# EasyEDA Pro project 电源管理.epro

# Schematic Schematic1
Create Date: 2023-06-20; Page Name: P1; Project Name: DC-DC_电源; Schematic Name: Schematic1; Update Date: 2023-06-20; Company: 嘉立创EDA; Page Size: A4; Version: V1.0
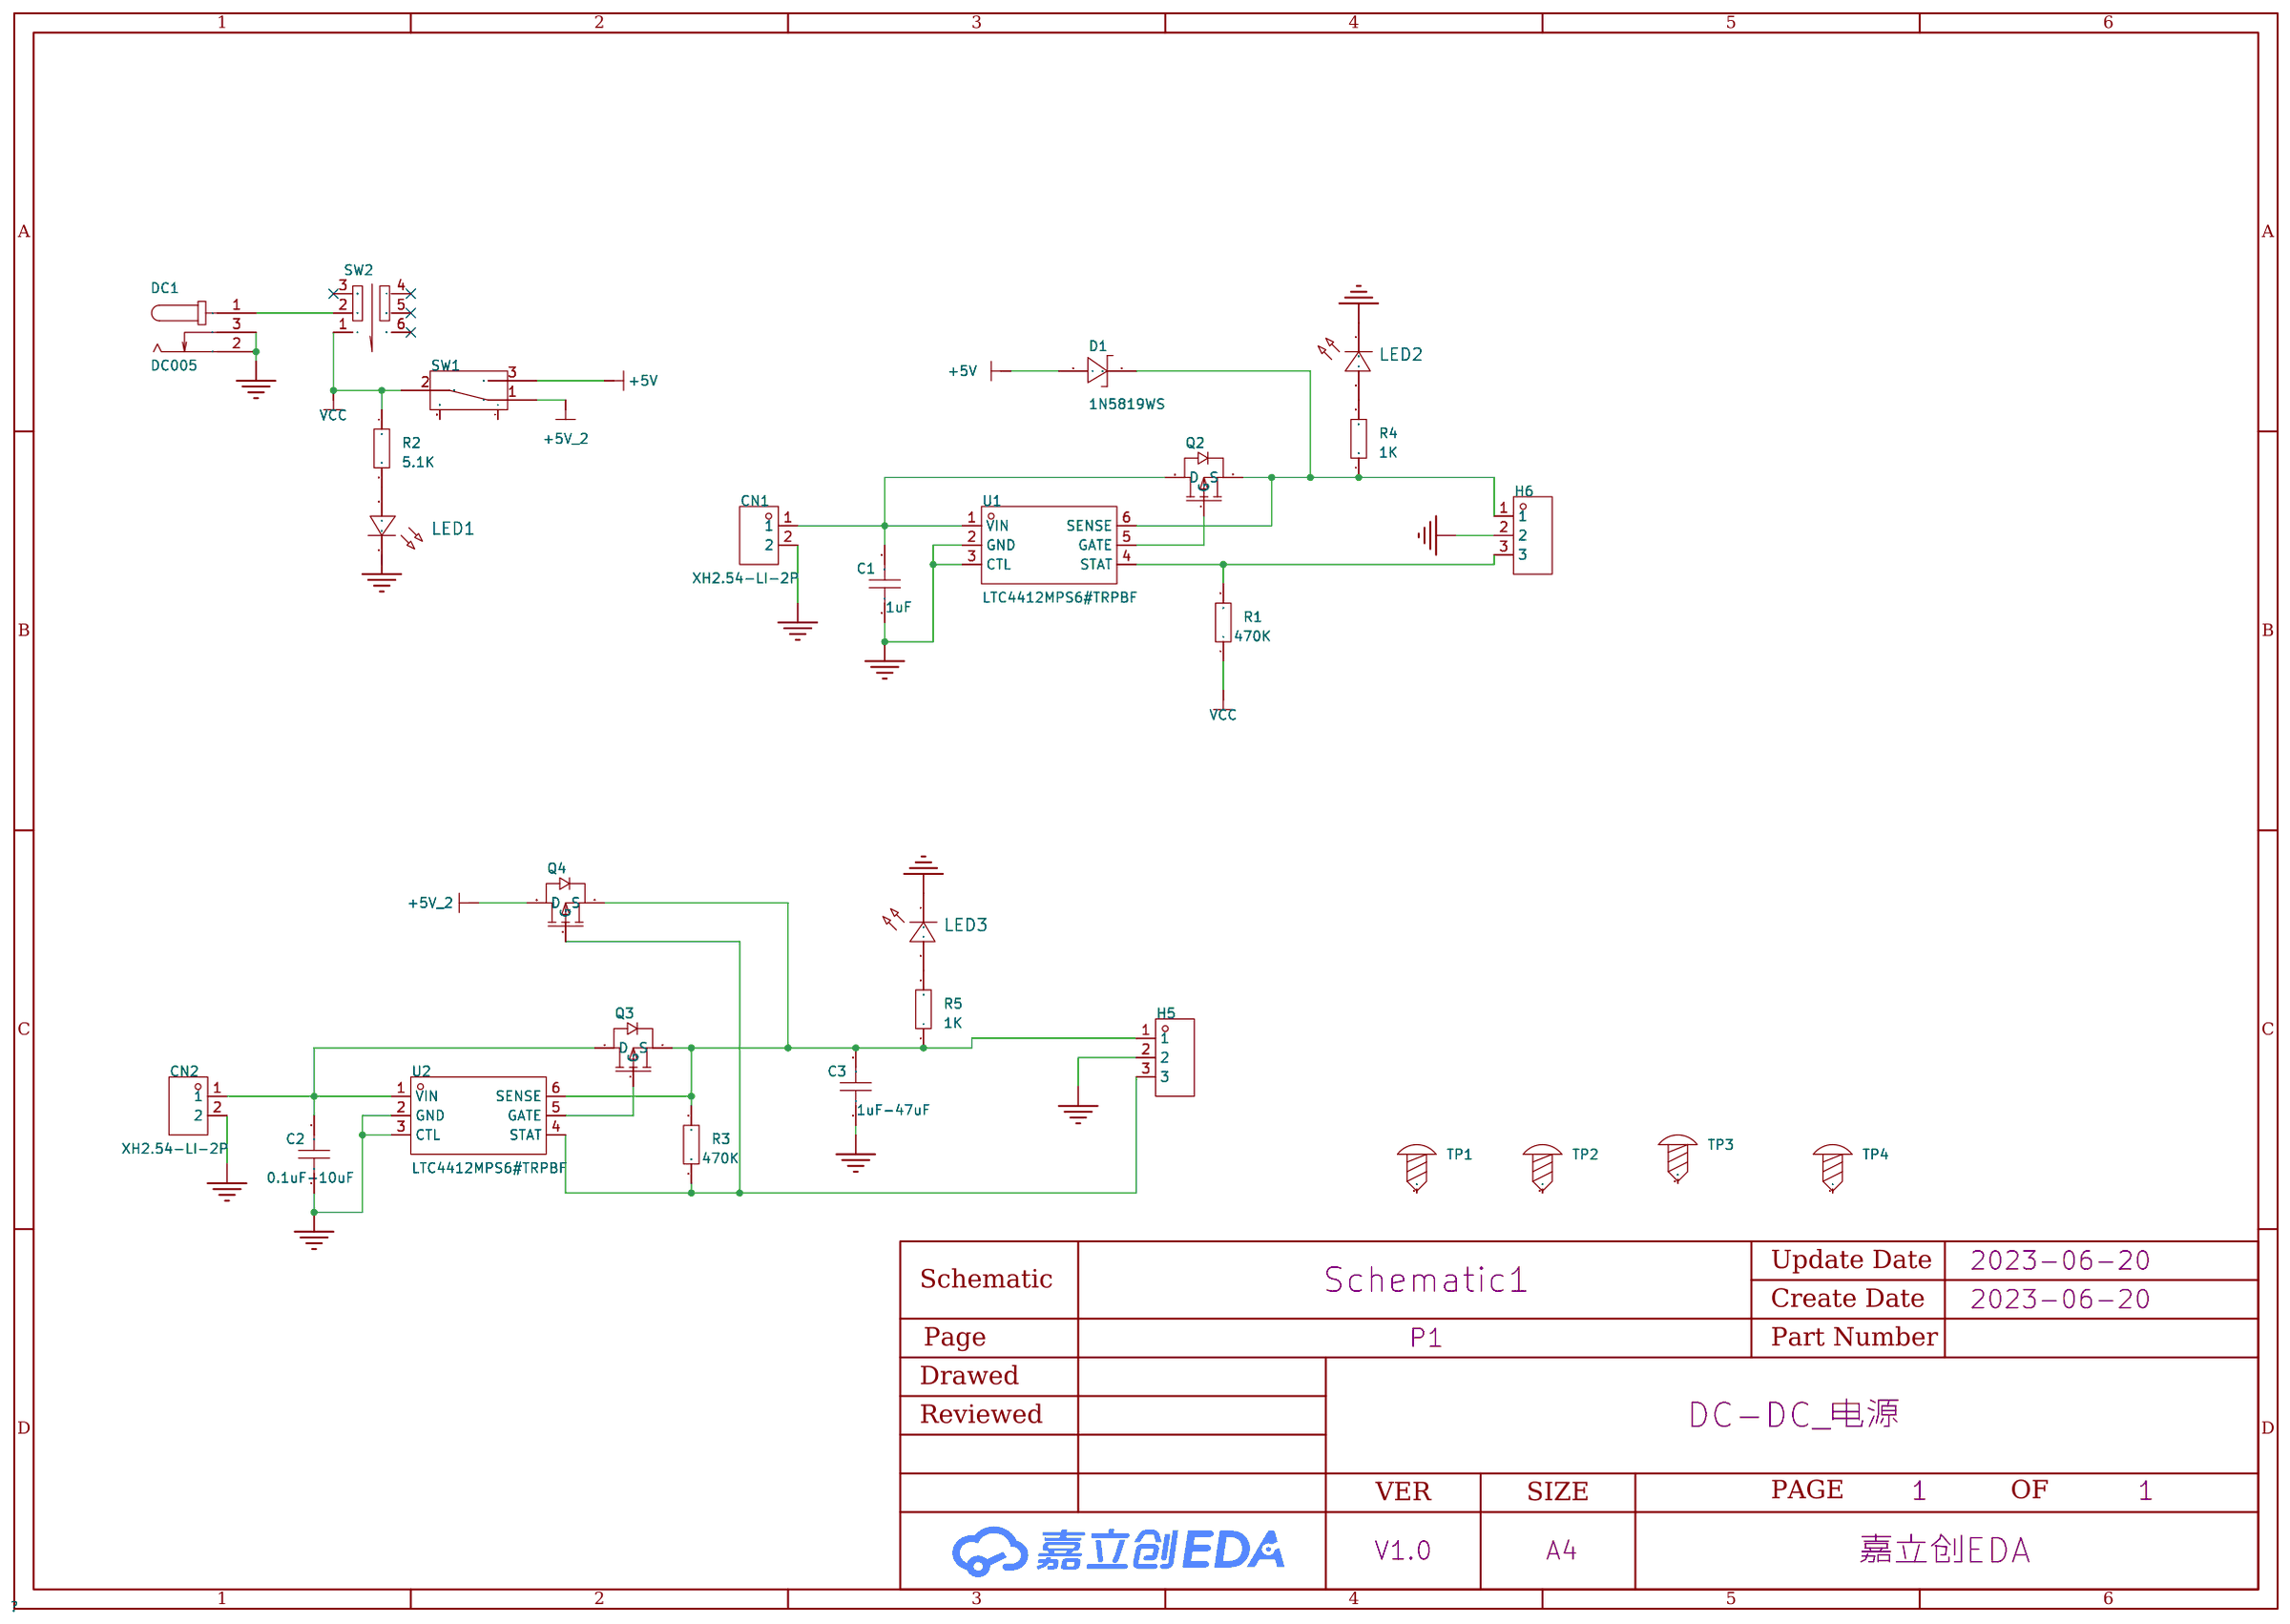
[diagram p0: schematic sheet]

## Parts
C1  1uF  [C0805]
C2  0.1uF-10uF  [C0805]
C3  1uF-47uF  [C0805]
CN1  XH2.54-LI-2P  [CONN-TH_2P-P2.54_HDR2]
CN2  XH2.54-LI-2P  [CONN-TH_2P-P2.54_HDR2]
D1  1N5819WS  [SOD-323_L1.8-W1.3-LS2.5-RD]
DC1  DC005  [DC-IN-TH_DC005]
H5  -  [HDR-TH_3P-P2.54-V-M]
H6  -  [HDR-TH_3P-P2.54-V-M]
LED1  -  [LED_0805]
LED2  -  [LED_0805]
LED3  -  [LED_0805]
Q2  -  [AO3401A_SOT-23-3]
Q3  -  [AO3401A_SOT-23-3]
Q4  -  [AO3401A_SOT-23-3]
R1  470K  [R0805]
R2  5.1K  [R0805]
R3  470K  [R0805]
R4  1K  [R0805]
R5  1K  [R0805]
SW1  -  [拨动开关]
SW2  自锁开关 5.8Z白灰白260G  [SW-TH_6P-L5.8-W5.8-P2.00-LS4.5-TR]
TP1  -  [M3螺丝]
TP2  -  [M3螺丝]
TP3  -  [M3螺丝]
TP4  -  [M3螺丝]
U1  LTC4412MPS6#TRPBF  [SOT-23-6_L2.9-W1.6-P0.95-LS2.8-BL]
U2  LTC4412MPS6#TRPBF  [SOT-23-6_L2.9-W1.6-P0.95-LS2.8-BL]

## Library data of the parts
C1-C3 = CAP_0805: Supplier Footprint: 0805
CN1 CN2 = XH2.54-LI-2P: Supplier Part: C9900023170; Supplier Footprint: CONN-TH_2[; JLCPCB Part Class: Extended Part; Supplier: LCSC
D1 = 1N5819WS_C191023: 直流反向耐压(Vr):40V;平均整流电流(Io):1A;正向压降(Vf):600mV@1A;; LCSC Part Name: 40V 1A 600mV@1A; Supplier Part: C191023; Manufacturer: Hottech(合科泰); Supplier Footprint: SOD-323; JLCPCB Part Class: Basic Part; Datasheet: https://atta.szlcsc.com/upload/public/pdf/source/20220428/3CB86FD8D28D653594B4E35F9D5AEFD9.pdf; Supplier: LCSC; Reverse Voltage (Vr): 40V; Average Rectified Current (Io): 1A; Forward Voltage (Vf@If): 600mV@1A
DC1 = DC005: 连接器类型:DC电源插座;安装方式:弯插;触点内径:2mm;触点外径:6.3mm;额定电流:500mA;额定电压:30V;工作温度范围:-40℃~+55℃;; LCSC Part Name: DC电源插座 内径:2mm 外径:6.3mm 铁材质; Supplier Part: C431533; Manufacturer: SHOU HAN(首韩); Supplier Footprint: 插件; JLCPCB Part Class: Extended Part; Datasheet: https://atta.szlcsc.com/upload/public/pdf/source/20190925/C431533_4751811035784AC1D38EBC85F7905E99.pdf; Supplier: LCSC; Connector Type: DC电源插座; Mounting Style: 弯插; Inside Contact Diameter: 2mm; Outside Contact Diameter: 6.3mm; Current Rating (Max): 500mA; Voltage Rating (Max): 30V; Operating Temperature Range: -40℃~+55℃
H5 H6 = HDR-M_2.54_1x3P: Supplier Part: C2937625; Supplier Footprint: 插件
LED1-LED3 = LED_0805-R: Supplier Footprint: 0805
Q2-Q4 = AO3401A_P: Supplier Footprint: SOT-23-3L; Supplier Part: C15127
R1-R5 = Res_0805: Supplier Footprint: 0805
SW1 = 拨动开关_正: Supplier Footprint: 插件
SW2 = 自锁开关 5.8Z白灰白260G: 耐温260度; LCSC Part Name: 自锁开关 5.8Z白灰白 260G  5.8*5.8mm; Supplier Part: C56857; Supplier Footprint: Through Hole; JLCPCB Part Class: Extended Part; Datasheet: https://atta.szlcsc.com/upload/public/pdf/source/20160318/1458266987096.pdf; Supplier: LCSC
TP1-TP4 = M3螺丝: Supplier Footprint: 插件
U1 U2 = LTC4412MPS6#TRPBF: 输入电压:2.5V~28V;; Supplier Part: C688483; Manufacturer: ADI(亚德诺); Supplier Footprint: SOT-23-6; JLCPCB Part Class: Extended Part; Datasheet: https://atta.szlcsc.com/upload/public/pdf/source/20191127/C459903_E07DB0C4019C6348E4B0C2B47053A4E9.pdf; Supplier: LCSC; Input Voltage: 2.5V~28V; Operating Temperature	-: -40℃~+125℃

## Nets
+5V: D1.2(A) SW1.3
+5V_2: Q4.3(D) SW1.1
GND: C1.1 C2.1 C3.1 CN1.2 CN2.2 DC1.2 DC1.3 H5.2 H6.2 LED1.1(C) LED2.1(C) LED3.1(C) U1.2(GND) U1.3(CTL) U2.2(GND) U2.3(CTL)
VCC: R1.1 R2.1 SW1.2 SW2.1
$1N424: Q2.1(G) U1.5(GATE)
$1N1051: LED1.2(A) R2.2
$1N1391: Q3.1(G) U2.5(GATE)
$1N1660: DC1.1 SW2.2
$1N1753: LED2.2(A) R4.2
$1N1817: LED3.2(A) R5.2
Net-(C1-2): C1.2 CN1.1 Q2.3(D) U1.1(VIN)
Net-(C2-2): C2.2 CN2.1 Q3.3(D) U2.1(VIN)
Net-(C3-2): C3.2 H5.1 Q3.2(S) Q4.2(S) R3.2 R5.1 U2.6(SENSE)
Net-(D1-1): D1.1(C) H6.1 Q2.2(S) R4.1 U1.6(SENSE)
Net-(H5-3): H5.3 Q4.1(G) R3.1 U2.4(STAT)
Net-(H6-3): H6.3 R1.2 U1.4(STAT)

Not connected (* = marked no-connect by the designer): SW1 4 5; SW2 3* 4* 5* 6*; TP1 1; TP2 1; TP3 1; TP4 1

# Schematic Schematic2
Create Date: 2023-07-04; Page Name: P1; Project Name: DC-DC_电源; Schematic Name: Schematic2; Update Date: 2023-07-08; Company: 嘉立创EDA; Page Size: A4; Version: V1.0
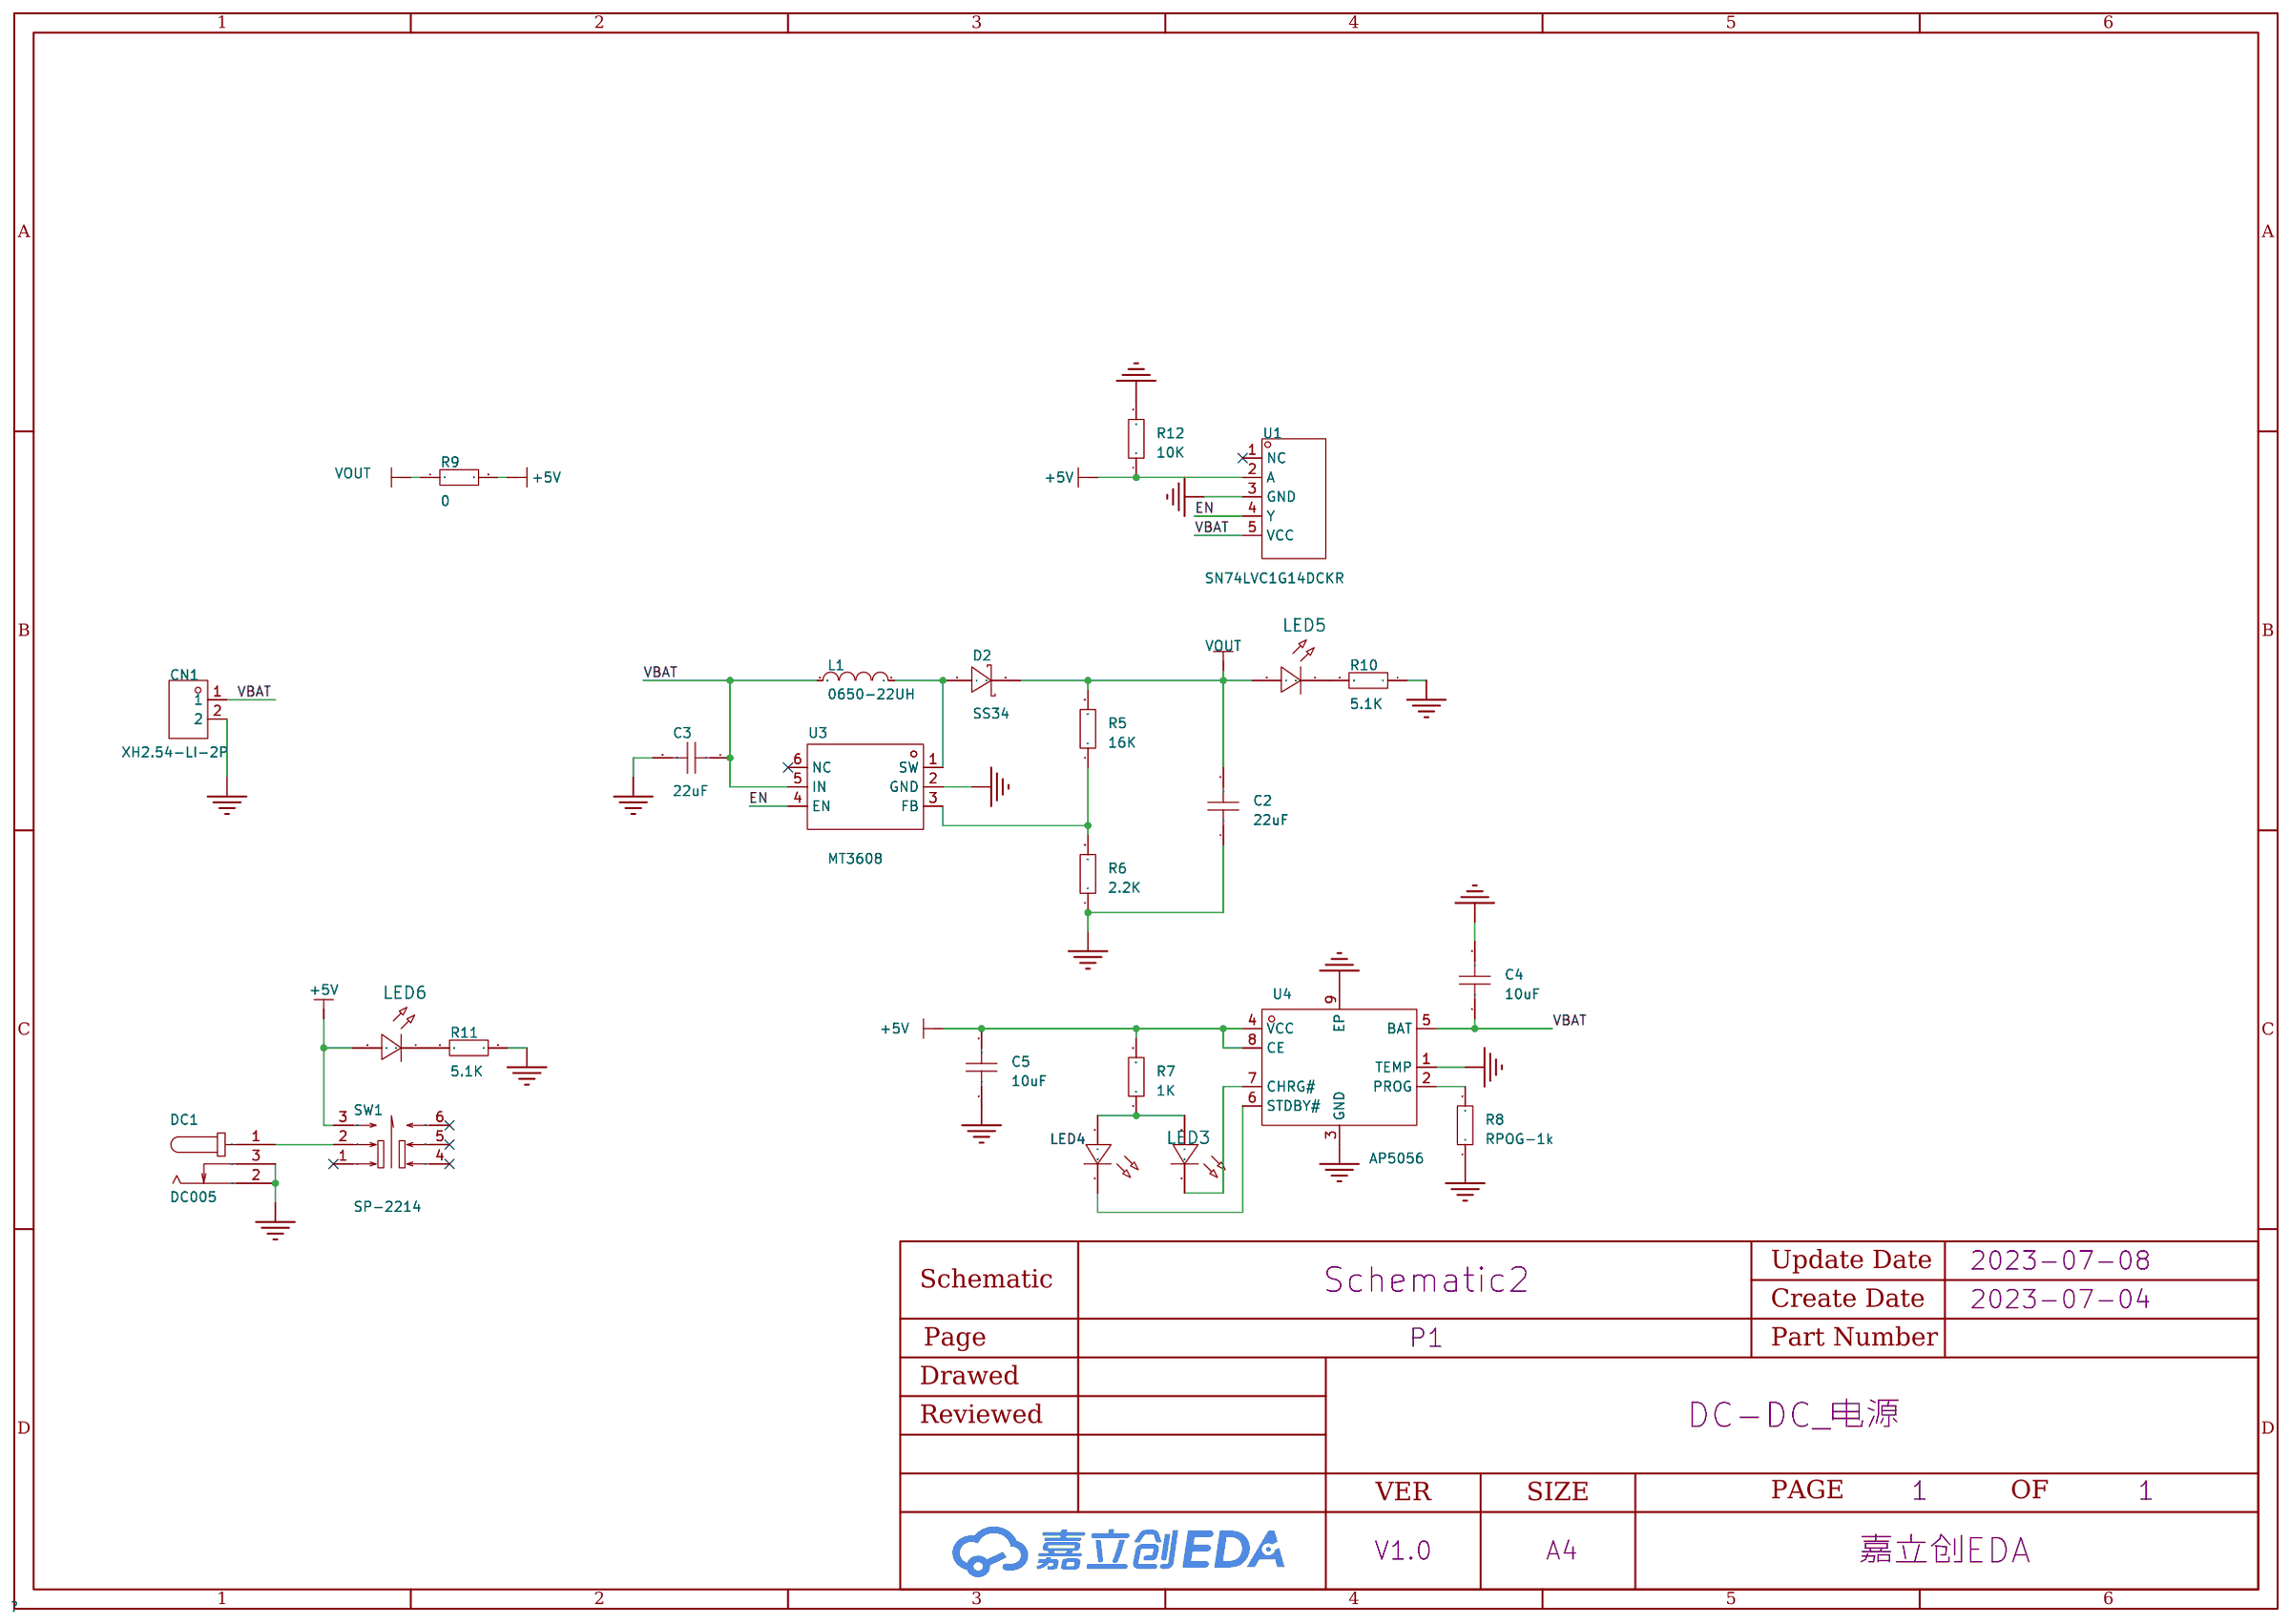
[diagram p1: schematic sheet]

## Parts
C2  22uF  [C0603]
C3  22uF  [C0603]
C4  10uF  [C0603]
C5  10uF  [C0603]
CN1  XH2.54-LI-2P  [CONN-TH_2P-P2.54_HDR2]
D2  SS34  [SMA_L4.3-W2.6-LS5.2-RD]
DC1  DC005  [DC-IN-TH_DC005]
L1  0650-22UH  [IND-SMD_L7.8-W7.0_MAPM0630F]
LED3  -  [LED_0603]
LED4  -  [LED_0603]
LED5  -  [LED_0603]
LED6  -  [LED_0603]
R5  16K  [R0603]
R6  2.2K  [R0603]
R7  1K  [R0603]
R8  RPOG-1k  [R0603]
R9  0  [R0603]
R10  5.1K  [R0603]
R11  5.1K  [R0603]
R12  10K  [R0603]
SW1  SP-2214  [SW-TH_6P-L8.5-W8.5-P2.54-LS5.5]
U1  SN74LVC1G14DCKR  [SOT-23-5_L2.9-W1.6-P0.95-LS2.8-BL]
U3  MT3608  [SOT-23-6_L2.9-W1.6-P0.95-LS2.8-BL]
U4  AP5056  [SOP-8_L4.9-W3.9-P1.27-LS6.0-BL-EP]

## Library data of the parts
C2-C5 = CAP_0603: Supplier Footprint: 0603
CN1 = XH2.54-LI-2P: Supplier Part: C9900023170; Supplier Footprint: CONN-TH_2[; JLCPCB Part Class: Extended Part; Supplier: LCSC
D2 = SS34_C8678: 二极管配置:独立式;直流反向耐压(Vr):40V;平均整流电流(Io):3A;正向压降(Vf):550mV@3A;; LCSC Part Name: 40V 3A 550mV@3A; Supplier Part: C8678; Manufacturer: MDD; Supplier Footprint: SMA(DO-214AC); JLCPCB Part Class: Basic Part; Datasheet: https://atta.szlcsc.com/upload/public/pdf/source/20230314/A80AE34493C69B89E2F4B1712F433538.pdf; Supplier: LCSC; Diode Configuration: 独立式; Reverse Voltage (Vr): 40V; Average Rectified Current (Io): 3A; Forward Voltage (Vf@If): 550mV@3A; Reverse Leakage Current (Ir): 500uA@40V
DC1 = DC005: 连接器类型:DC电源插座;安装方式:弯插;触点内径:2mm;触点外径:6.3mm;额定电流:500mA;额定电压:30V;工作温度范围:-40℃~+55℃;; LCSC Part Name: DC电源插座 内径:2mm 外径:6.3mm 铁材质; Supplier Part: C431533; Manufacturer: SHOU HAN(首韩); Supplier Footprint: 插件; JLCPCB Part Class: Extended Part; Datasheet: https://atta.szlcsc.com/upload/public/pdf/source/20190925/C431533_4751811035784AC1D38EBC85F7905E99.pdf; Supplier: LCSC; Connector Type: DC电源插座; Mounting Style: 弯插; Inside Contact Diameter: 2mm; Outside Contact Diameter: 6.3mm; Current Rating (Max): 500mA; Voltage Rating (Max): 30V; Operating Temperature Range: -40℃~+55℃
L1 = 0650-2.2UH: Supplier Part: C9900012394; Supplier Footprint: SMD_0650; JLCPCB Part Class: Extended Part; Datasheet: https://atta.szlcsc.comnull; Supplier: LCSC
LED3 LED5 LED6 = LED_0603-R: Supplier Footprint: 0603
LED4 = LED_0603-G: Supplier Footprint: 0603
R5-R12 = Res_0603: Supplier Footprint: 0603
SW1 = SP-2214: 触点电流:100mA;额定电压 (DC):30V;绝缘电阻:100MΩ;电路结构:双刀双掷;安装方式:直插;自锁/无锁:自锁;按键形状:矩形柱塞;按键/盖帽颜色:白色;引脚样式:PC引脚;作用力:240gf@±80gf;机械寿命:12000;; LCSC Part Name: 自锁开关; Supplier Part: C589291; Manufacturer: RISHENG(日昇); Supplier Footprint: 插件; JLCPCB Part Class: Extended Part; Datasheet: https://atta.szlcsc.com/upload/public/pdf/source/20200922/C589291_4D429B32154294A859CAFC63DE03822C.pdf; Supplier: LCSC; Contact Current: 100mA; Voltage Rating (DC): 30V; Insulation Resistance: 100MΩ; Circuit: 双刀双掷; Mounting Style: 直插; Self Lock / No Lock: 自锁; Actuator Style: 矩形柱塞; Actuator/Cap Color: 白色; Pin Style: PC引脚; Operating Force: 240gf@±80gf; Mechanical Life: 12000
U1 = SN74LVC1G14DCKR: 输入类型:施密特触发器;通道数:1;电源电压:1.65V~5.5V;电源电流(最大值):10uA;最大传播延迟(tpd):5ns@5V,50pF;; LCSC Part Name: 单路施密特触发反相器; Supplier Part: C35740; Manufacturer: TI(德州仪器); Supplier Footprint: SC-70-5; JLCPCB Part Class: Extended Part; Datasheet: https://atta.szlcsc.com/upload/public/pdf/source/20160416/1460799387530.pdf; Supplier: LCSC; Series: 74LVC; Input Type: 施密特触发器; Number of channels: 1; Supply Voltage(Single): 1.65V~5.5V; Supply Current (Max): 10uA; Sink Current: 32mA; Source Current: 32mA; High level range (VIH): 1.16V~3.33V; Low level range (VIL): 390mV~1.87V; Max Propagation Delay: 5ns@5V,50pF
U3 = MT3608: 功能类型:升压型;输入电压:2V~24V;输出电压:28V;输出电流(最大值):-;; LCSC Part Name: 升压型 输入2V~24V 输出28V; Supplier Part: C84817; Manufacturer: 西安航天民芯; Supplier Footprint: SOT-23-6; JLCPCB Part Class: Extended Part; Datasheet: https://atta.szlcsc.com/upload/public/pdf/source/20161110/1478743351706.pdf; Supplier: LCSC; Function: 升压型; Number of Outputs: 1; Topology: 升压式; Input Voltage: 2V~24V; Output Voltage: 28V; Switching Frequency: 1.2MHz
U4 = AP5056: 常用锂电池充电芯片，功能同TP4056; Supplier Part: C81910; Manufacturer: chipown(芯朋微电子); Supplier Footprint: SOP-8-EP; JLCPCB Part Class: Extended Part; Datasheet: https://atta.szlcsc.com/upload/public/pdf/source/20170918/C81910_1505700200349975039.pdf; Supplier: LCSC

## Nets
+5V: C5.2 LED6.2(A) R7.2 R9.2 R12.1 SW1.3 U1.2(A) U4.4(VCC) U4.8(CE)
GND: C2.1 C3.2 C4.2 C5.1 CN1.2 DC1.2 DC1.3 R6.1 R8.1 R10.1 R11.1 R12.2 U1.3(GND) U3.2(GND) U4.1(TEMP) U4.3(GND) U4.9(EP)
VBAT: C3.1 C4.1 CN1.1 L1.1 U1.5(VCC) U3.5(IN) U4.5(BAT)
EN: U1.4(Y) U3.4(EN)
VOUT: C2.2 D2.1(K) LED5.2(A) R5.2 R9.1
$1N741: D2.2(A) L1.2 U3.1(SW)
$1N828: R5.1 R6.2 U3.3(FB)
$1N1510: DC1.1 SW1.2
$1N2340: LED3.2(A) LED4.2(A) R7.1
$1N2345: LED3.1(C) U4.7(CHRG#)
$1N2357: LED4.1(C) U4.6(STDBY#)
$1N2904: R8.2 U4.2(PROG)
$1N3168: LED5.1(C) R10.2
$1N3244: LED6.1(C) R11.2

Not connected (* = marked no-connect by the designer): SW1 1* 4* 5* 6*; U1 1(NC)*; U3 6(NC)*

# Schematic Schematic3
Create Date: 2023-07-08; Page Name: P1; Project Name: DC-DC_电源; Schematic Name: Schematic3; Update Date: 2023-07-08; Company: 嘉立创EDA; Page Size: A4; Version: V1.0
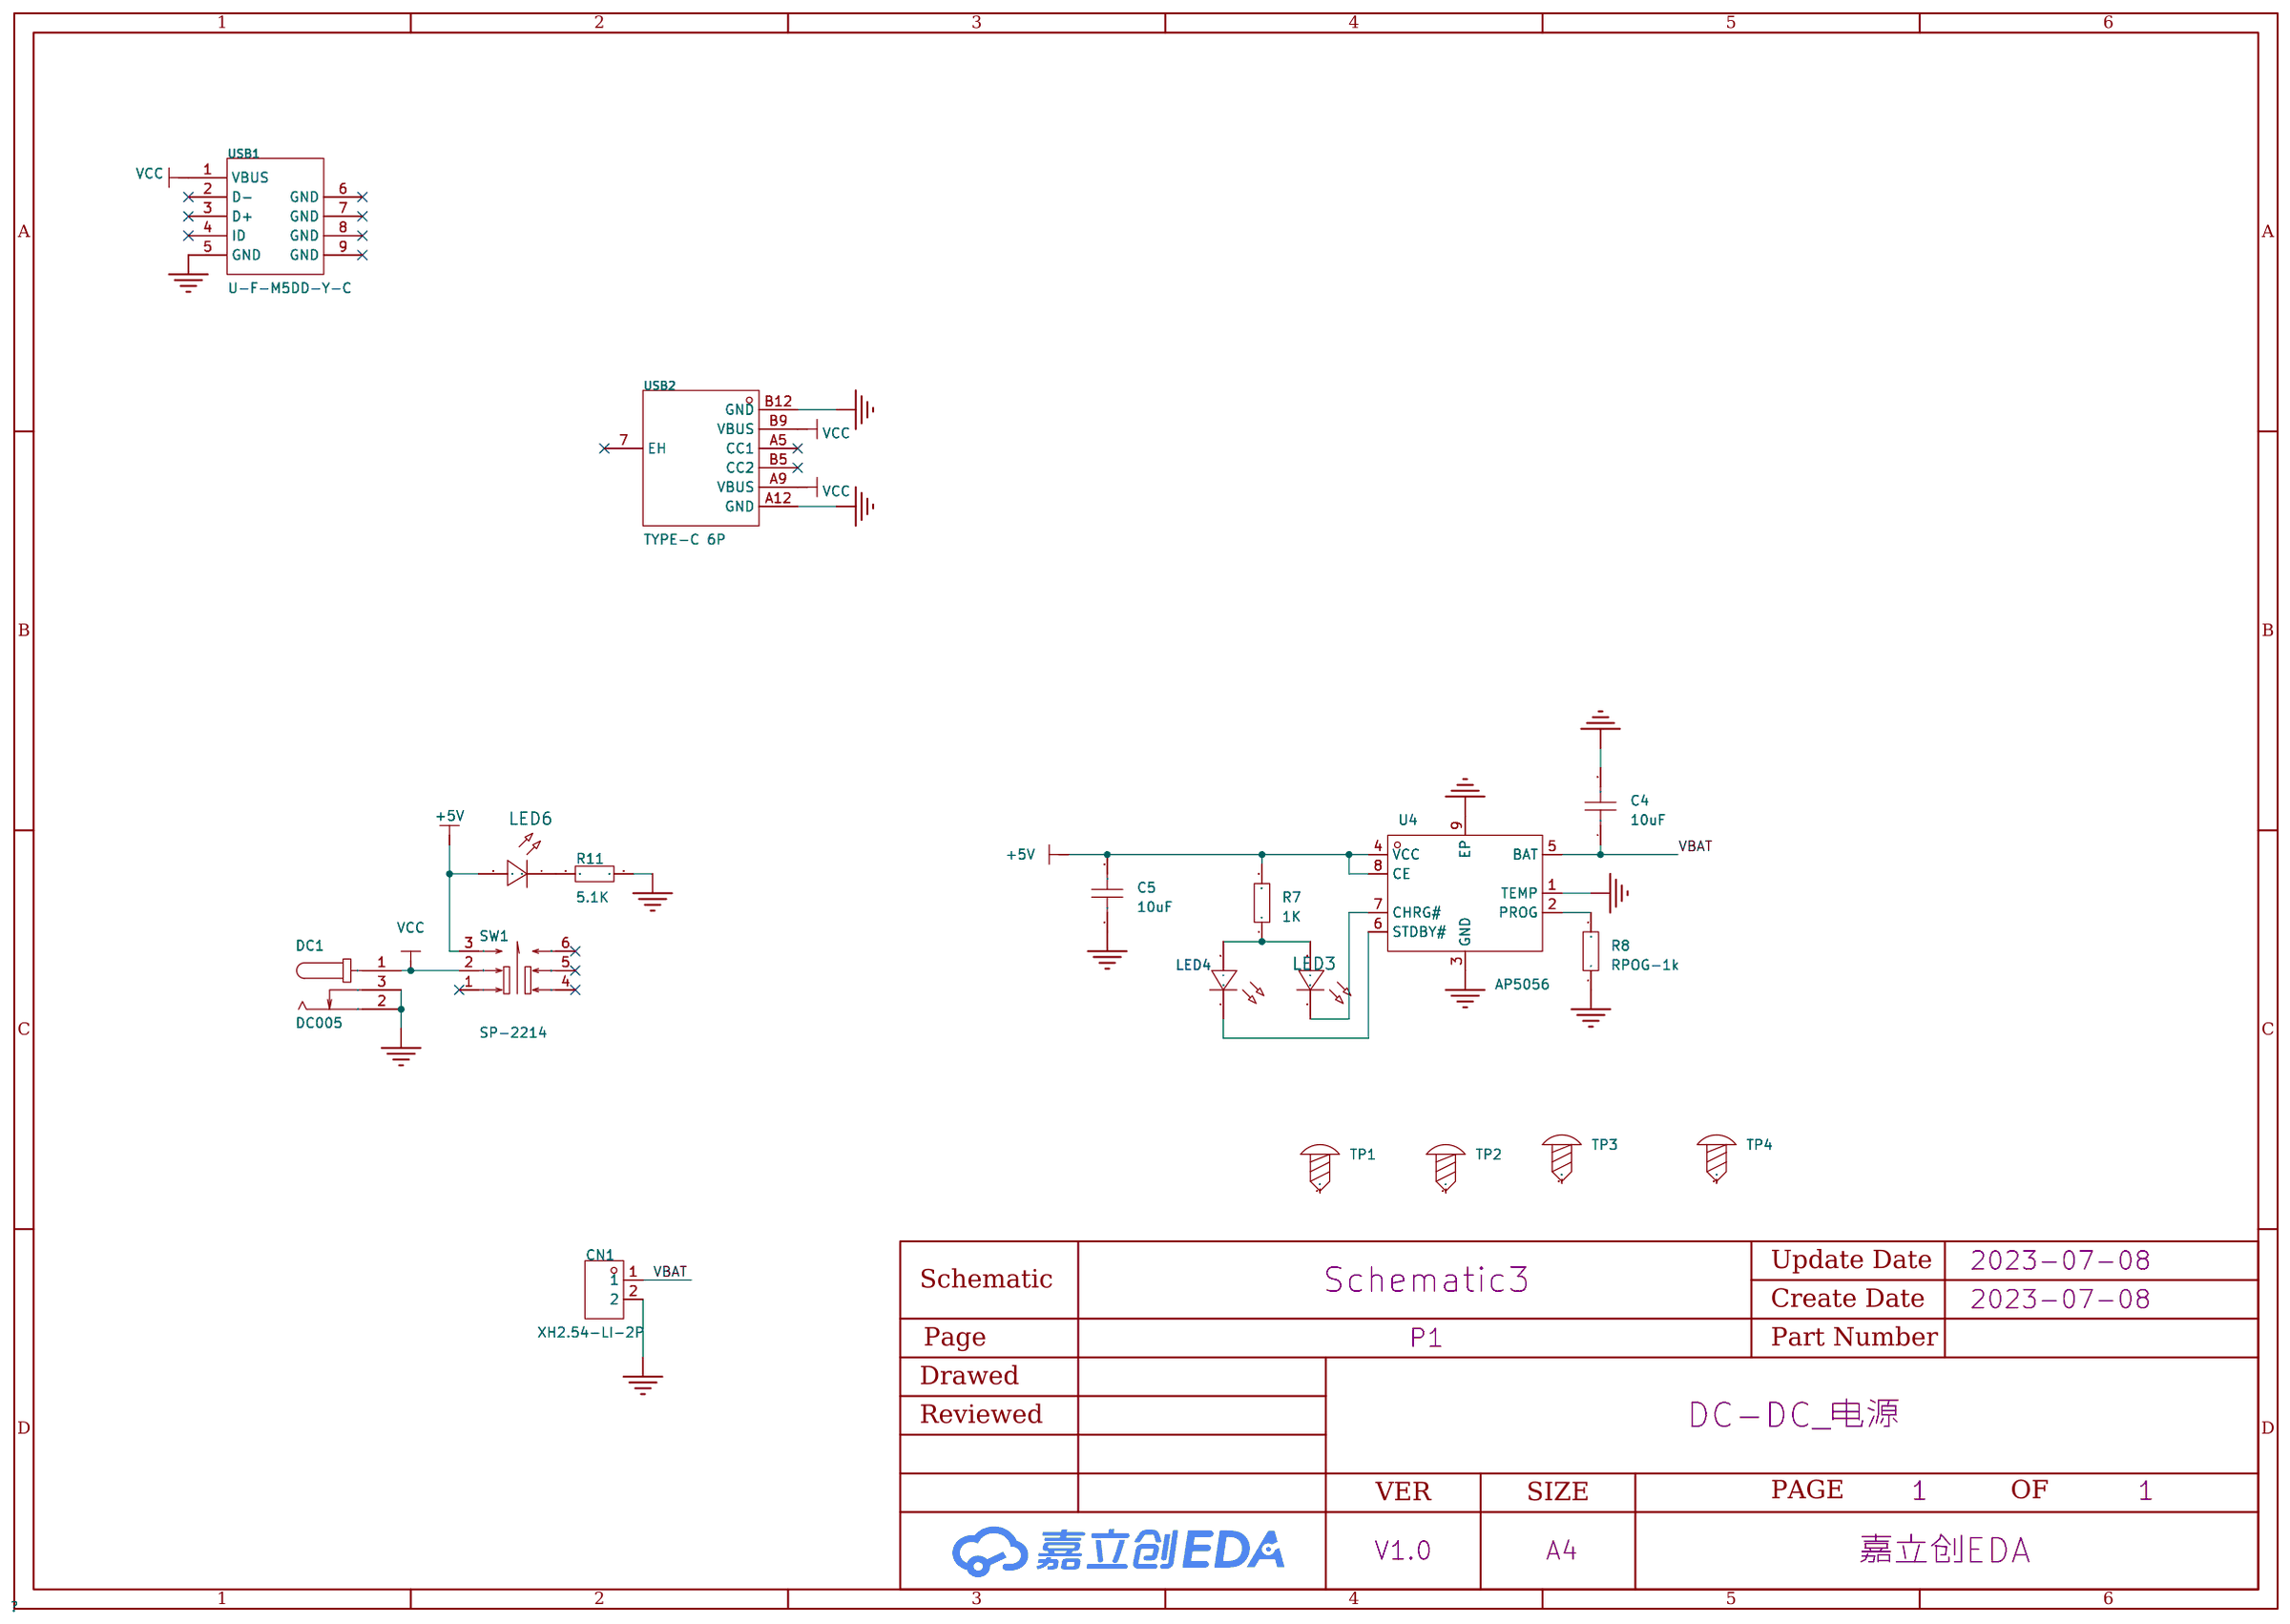
[diagram p2: schematic sheet]

## Parts
C4  10uF  [C0603]
C5  10uF  [C0603]
CN1  XH2.54-LI-2P  [CONN-TH_2P-P2.54_HDR2]
DC1  DC005  [DC-IN-TH_DC005]
LED3  -  [LED_0603]
LED4  -  [LED_0603]
LED6  -  [LED_0603]
R7  1K  [R0603]
R8  RPOG-1k  [R0603]
R11  5.1K  [R0603]
SW1  SP-2214  [SW-TH_6P-L8.5-W8.5-P2.54-LS5.5]
TP1  -  [M3螺丝]
TP2  -  [M3螺丝]
TP3  -  [M3螺丝]
TP4  -  [M3螺丝]
U4  AP5056  [SOP-8_L4.9-W3.9-P1.27-LS6.0-BL-EP]
USB1  U-F-M5DD-Y-C  [MICRO-USB-SMD_U-F-M5DD-Y-C]
USB2  TYPE-C 6P  [TYPE-C-SMD_TYPE-C-6P]

## Library data of the parts
C4 C5 = CAP_0603: Supplier Footprint: 0603
CN1 = XH2.54-LI-2P: Supplier Part: C9900023170; Supplier Footprint: CONN-TH_2[; JLCPCB Part Class: Extended Part; Supplier: LCSC
DC1 = DC005: 连接器类型:DC电源插座;安装方式:弯插;触点内径:2mm;触点外径:6.3mm;额定电流:500mA;额定电压:30V;工作温度范围:-40℃~+55℃;; LCSC Part Name: DC电源插座 内径:2mm 外径:6.3mm 铁材质; Supplier Part: C431533; Manufacturer: SHOU HAN(首韩); Supplier Footprint: 插件; JLCPCB Part Class: Extended Part; Datasheet: https://atta.szlcsc.com/upload/public/pdf/source/20190925/C431533_4751811035784AC1D38EBC85F7905E99.pdf; Supplier: LCSC; Connector Type: DC电源插座; Mounting Style: 弯插; Inside Contact Diameter: 2mm; Outside Contact Diameter: 6.3mm; Current Rating (Max): 500mA; Voltage Rating (Max): 30V; Operating Temperature Range: -40℃~+55℃
LED3 LED6 = LED_0603-R: Supplier Footprint: 0603
LED4 = LED_0603-G: Supplier Footprint: 0603
R7 R8 R11 = Res_0603: Supplier Footprint: 0603
SW1 = SP-2214: 触点电流:100mA;额定电压 (DC):30V;绝缘电阻:100MΩ;电路结构:双刀双掷;安装方式:直插;自锁/无锁:自锁;按键形状:矩形柱塞;按键/盖帽颜色:白色;引脚样式:PC引脚;作用力:240gf@±80gf;机械寿命:12000;; LCSC Part Name: 自锁开关; Supplier Part: C589291; Manufacturer: RISHENG(日昇); Supplier Footprint: 插件; JLCPCB Part Class: Extended Part; Datasheet: https://atta.szlcsc.com/upload/public/pdf/source/20200922/C589291_4D429B32154294A859CAFC63DE03822C.pdf; Supplier: LCSC; Contact Current: 100mA; Voltage Rating (DC): 30V; Insulation Resistance: 100MΩ; Circuit: 双刀双掷; Mounting Style: 直插; Self Lock / No Lock: 自锁; Actuator Style: 矩形柱塞; Actuator/Cap Color: 白色; Pin Style: PC引脚; Operating Force: 240gf@±80gf; Mechanical Life: 12000
TP1-TP4 = M3螺丝: Supplier Footprint: 插件
U4 = AP5056: 常用锂电池充电芯片，功能同TP4056; Supplier Part: C81910; Manufacturer: chipown(芯朋微电子); Supplier Footprint: SOP-8-EP; JLCPCB Part Class: Extended Part; Datasheet: https://atta.szlcsc.com/upload/public/pdf/source/20170918/C81910_1505700200349975039.pdf; Supplier: LCSC
USB1 = U-F-M5DD-Y-C: 连接器类型:Micro-B;标准:USB 2.0;公母:母座;触点数量:5;端口数量:1;安装方式:卧贴;额定电流 - 电源:1A;工作温度范围:-;; LCSC Part Name: 牛角 插件; Supplier Part: C530640; Manufacturer: 韩国韩荣; Supplier Footprint: SMD; JLCPCB Part Class: 扩展库; Supplier: LCSC; Connector Type: Micro-B; Standard: USB 2.0; Gender: 母座; Number of Contacts: 5; Number of Ports: 1; Mounting Style: 卧贴; Current Rating - Power (Max): 1A
USB2 = TYPE-C 6P: 连接器类型:Type-C;标准:-;公母:母座;触点数量:6P;端口数量:1;安装方式:卧贴;额定电流 - 电源:-;工作温度范围:-40℃~+85℃;; LCSC Part Name: Type-C 母座 卧贴; Supplier Part: C456012; Manufacturer: SHOU HAN(首韩); Supplier Footprint: SMD; JLCPCB Part Class: Extended Part; Datasheet: https://atta.szlcsc.com/upload/public/pdf/source/20201203/C456012_B13F72044DF846EDBE9BDD0D1D3CD166.pdf; Supplier: LCSC; Connector Type: Type-C; Gender: 母座; Number of Contacts: 6P; Number of Ports: 1; Mounting Style: 卧贴; Operating Temperature Range: -40℃~+85℃

## Nets
+5V: C5.2 LED6.2(A) R7.2 SW1.3 U4.4(VCC) U4.8(CE)
GND: C4.2 C5.1 CN1.2 DC1.2 DC1.3 R8.1 R11.1 U4.1(TEMP) U4.3(GND) U4.9(EP) USB1.5(GND) USB2.A12(GND) USB2.B12(GND)
VBAT: C4.1 CN1.1 U4.5(BAT)
VCC: DC1.1 SW1.2 USB1.1(VBUS) USB2.A9(VBUS) USB2.B9(VBUS)
Net-(LED3-1): LED3.1(C) U4.7(CHRG#)
Net-(LED3-2): LED3.2(A) LED4.2(A) R7.1
Net-(LED4-1): LED4.1(C) U4.6(STDBY#)
Net-(LED6-1): LED6.1(C) R11.2
Net-(R8-2): R8.2 U4.2(PROG)

Not connected (* = marked no-connect by the designer): SW1 1* 4* 5* 6*; TP1 1; TP2 1; TP3 1; TP4 1; USB1 2(D-)* 3(D+)* 4(ID)* 6(GND)* 7(GND)* 8(GND)* 9(GND)*; USB2 7(EH)* A5(CC1)* B5(CC2)*

# Board PCB2
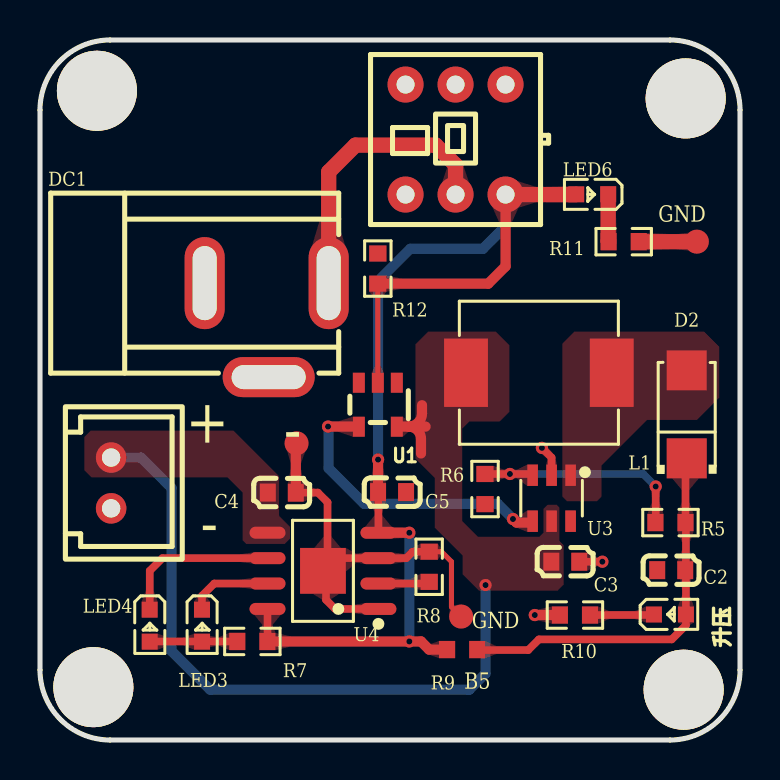
[diagram p3: board, top side]
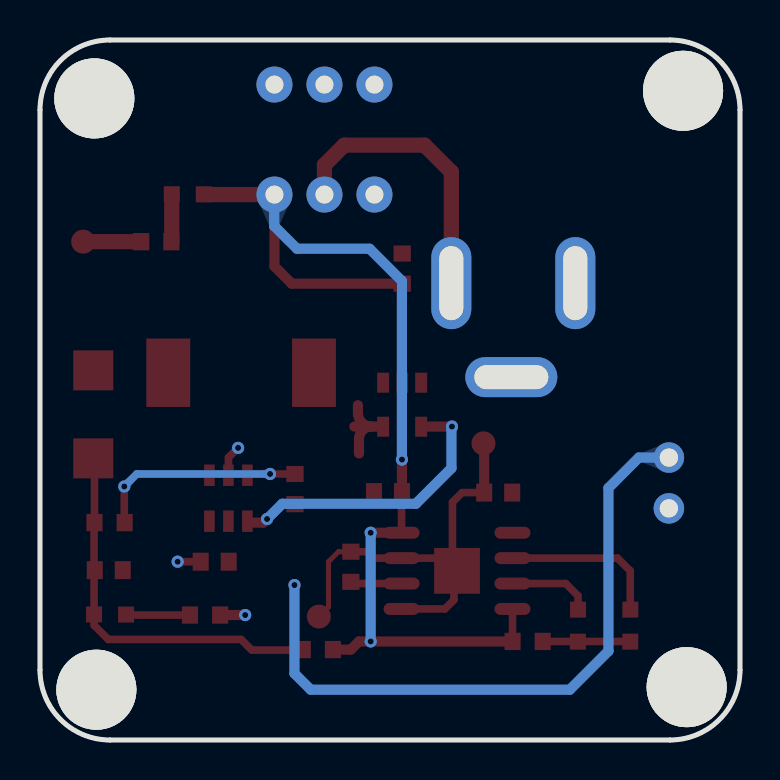
[diagram p4: board, bottom side, seen from below]

Outline 35 x 35 mm; copper layers: Top Layer, Bottom Layer. Coordinates in mm from the lower left corner of the outline.
Outline path: 0,31.5 0,3.5 arc(1.03,1.03) 3.5,0 31.5,0 arc(33.97,1.03) 35,3.5 35,31.5 arc(33.97,33.97) 31.5,35 3.5,35 arc(1.03,33.97) 0,31.5
Stack: Top Layer 0.035mm / Dielectric1 1.51mm FR4 er 4.5 / Bottom Layer 0.035mm

## Design rules (mm)
template: JLCPCB Capability(Two Layers Board)
spacing copperThickness1oz (default): track to track 0.102, other pairs 0.152 to 0.3
spacing copperThickness2oz: track to track 0.203, other pairs 0.152 to 0.3
track width copperThickness1oz (default): min 0.127, default 0.254, max 2.54
track width copperThickness2oz: min 0.203, default 0.254, max 2.54
differential pair differentialPair (default): width min 0.127, default 0.254, max 2.54; gap min 0.152, default 0.152
via viaSize (default): diameter min 0.5, default 0.61, max 10; hole min 0.3, default 0.305, max 6.3

## Placement (name value [footprint] x y rotation side)
C2  22uF  [C0603]  31.56 8.49 0 top
C3  22uF  [C0603]  26.26 8.91 0 top
C4  10uF  [C0603]  12.09 12.37 0 top
C5  10uF  [C0603]  17.6 12.39 180 top
CN1  XH2.54-LI-2P  [CONN-TH_2P-P2.54_HDR2]  3.56 12.85 270 top
D2  SS34  [SMA_L4.3-W2.6-LS5.2-RD]  32.33 16.28 90 top
DC1  DC005  [DC-IN-TH_DC005]  11.33 20.49 0 top
L1  0650-22UH  [IND-SMD_L7.8-W7.0_MAPM0630F]  24.94 18.36 180 top
LED3  -  [LED_0603]  8.11 5.67 270 top
LED4  -  [LED_0603]  5.49 5.67 270 top
LED5  -  [LED_0603]  31.55 6.28 0 top
LED6  -  [LED_0603]  27.56 27.28 180 top
NOREF  -  [Pad_e155]  32.84 24.92 0 top
NOREF#2  -  [Pad_e504]  21.06 6.17 0 top
NOREF#3  -  [Pad_e385]  12.83 14.83 0 top
NOREF#4  -  [Pad_e78]  2.67 2.64 0 top
NOREF#5  -  [Pad_e80]  32.28 32.08 0 top
NOREF#6  -  [Pad_e75]  2.84 32.46 0 top
NOREF#7  -  [Pad_e79]  32.18 2.51 0 top
R5  16K  [R0603]  31.52 10.87 0 top
R6  2.2K  [R0603]  22.25 12.55 90 top
R7  1K  [R0603]  10.62 4.93 0 top
R8  RPOG-1k  [R0603]  19.46 8.66 270 top
R9  0  [R0603]  21.11 4.52 180 top
R10  5.1K  [R0603]  26.75 6.25 0 top
R11  5.1K  [R0603]  29.18 24.92 180 top
R12  10K  [R0603]  16.89 23.57 90 top
SW1  SP-2214  [SW-TH_6P-L8.5-W8.5-P2.54-LS5.5]  20.78 30.02 0 top
U1  SN74LVC1G14DCKR  [SOT-23-5_L2.9-W1.6-P0.95-LS2.8-BL]  16.89 16.76 180 top
U3  MT3608  [SOT-23-6_L2.9-W1.6-P0.95-LS2.8-BL]  25.58 12.09 180 top
U4  AP5056  [SOP-8_L4.9-W3.9-P1.27-LS6.0-BL-EP]  14.15 8.46 90 top

## Footprints (pads in the part's own frame, mm; a bottom-side part is the same pattern mirrored in y, then rotated)
C0603
  rect 0.8x0.9 smd: 1(-0.7,0) 2(0.7,0)
CONN-TH_2P-P2.54_HDR2
  round 1.524 hole 0.914: 1(-1.27,0) 2(1.27,0)
DC-IN-TH_DC005
  oval 2x4.6 hole 1.2x3.7: 1(3.1,2.35) 2(-3.1,2.35)
  oval 4.6x2 hole 3.7x1.2: 3(0.1,-2.35)
IND-SMD_L7.8-W7.0_MAPM0630F
  rect 2.194x3.42 smd: 1(3.643,0) 2(-3.643,0)
LED_0603
  rect 0.8x0.8 smd: 1(-0.851,-0.01) 2(0.75,-0.005)
Pad_e75
  round 4 hole 4: 1(0,0)
Pad_e78
  round 4 hole 4: 1(0,0)
Pad_e79
  round 4 hole 4: 1(0,0)
Pad_e80
  round 4 hole 4: 1(0,0)
Pad_e155
  round 1.2 smd: 2(0,0)
Pad_e385
  round 1.2 smd: 2(0,0)
Pad_e504
  round 1.2 smd: 2(0,0)
R0603
  rect 0.806x0.864 smd: 1(-0.753,0) 2(0.753,0)
SMA_L4.3-W2.6-LS5.2-RD
  rect 2x2 smd: 1(-2.2,0) 2(2.2,0)
SOP-8_L4.9-W3.9-P1.27-LS6.0-BL-EP
  oval 0.6x1.8 smd: 1(-1.905,-2.772) 2(-0.635,-2.772) 3(0.635,-2.772) 4(1.905,-2.772) 5(1.905,2.772) 6(0.635,2.772) 7(-0.635,2.772) 8(-1.905,2.772)
  rect 2.29x2.29 smd: 9(0,0)
SOT-23-5_L2.9-W1.6-P0.95-LS2.8-BL
  rect 0.6x1 smd: 1(-0.95,-1.1) 2(0,-1.1) 3(0.95,-1.1) 4(0.95,1.1) 5(-0.95,1.1)
SOT-23-6_L2.9-W1.6-P0.95-LS2.8-BL
  rect 0.532x1.072 smd: 1(-0.95,-1.149) 2(0,-1.149) 3(0.95,-1.149) 4(0.95,1.149) 5(0,1.149) 6(-0.95,1.149)
SW-TH_6P-L8.5-W8.5-P2.54-LS5.5
  round 1.8 hole 0.9: 1(-2.5,-2.75) 2(0,-2.75) 3(2.5,-2.75) 4(-2.5,2.75) 5(0,2.75) 6(2.5,2.75)

## Nets
As in the schematic, except:
GND: C2.1 C3.2 C4.2 C5.1 CN1.2 DC1.2 DC1.3 NOREF.2 NOREF#2.2 NOREF#3.2 R6.1 R8.1 R10.1 R11.1 R12.2 U1.3 U3.2 U4.1 U4.3 U4.9

Pads without a net: NOREF#4 1; NOREF#5 1; NOREF#6 1; NOREF#7 1; SW1 1 4 5 6; U1 1; U3 6

## Via types
v1: diameter 0.61, hole 0.305, Top Layer to Bottom Layer, 11 vias

## Routing (per net, layer and track width the routed paths; a pad name or vN(x,y) marks a point on that pad's centre or on a via; arc(x,y) is an arc through that point)
+5V: length 58.3
  Top Layer w0.254: U1.2 16.89,22.77 16.94,22.82
  Top Layer w0.381: 11.38,6.55 11.38,5.02 11.47,4.93 ; U4.4 16.92,12.38 C5.2
  Top Layer w0.508: SW1.3 23.28,23.68 22.41,22.82 16.94,22.82 ; U4.4 v1(18.47,10.36) ; R7.2 v1(18.47,4.93) 19.05,4.93 19.46,4.52 R9.2 ; C5.2 v1(16.9,14.02)
  Top Layer w0.762: 26.81,27.28 26.8,27.27 SW1.3
  Bottom Layer w0.508: v1(18.47,4.93) v1(18.47,10.36) ; SW1.3 23.29,27.26 23.29,25.7 22.15,24.56 18.52,24.56 16.9,22.95 v1(16.9,14.02)
GND: length 28.3
  Top Layer w0.254: R8.1 20.07,9.41 20.57,8.91 20.57,6.65 NOREF#2.2
  Top Layer w0.381: R8.1 18.64,9.41 18.31,9.09 U4.3 14.78,9.09 14.65,8.96 ; v1(25.1,14.6) 25.58,14.12 U3.2 ; C4.2 13.89,12.37 14.38,11.89 14.38,8.69 U4.9 14.3,8.31 14.3,7.01 14.76,6.55 U4.1 ; 26.96,8.91 v1(28.12,8.91)
  Top Layer w0.508: NOREF#3.2 12.79,14.8 C4.2 ; R10.1 v1(24.74,6.25)
  Top Layer w0.762: NOREF.2 R11.1
VBAT: length 37.7
  Top Layer w0.508: 19.1,16.74 19.1,16.34 arc(18.91,15.87) 18.43,15.67 ; U1.5 17.84,15.67 18.43,15.67 ; 19.05,14.33 19.05,15.06 arc(18.87,15.49) 18.43,15.67 ; 18.43,15.67 19.28,15.67
  Bottom Layer w0.508: v1(22.28,7.75) 22.28,3.33 21.46,2.51 8.51,2.51 6.58,4.44 6.58,12.6 5.05,14.12 3.56,14.12
EN: length 15
  Top Layer w0.508: 24.63,10.94 24.56,10.87 23.83,10.87 v1(23.65,11.05) ; v1(14.4,15.67) 15.93,15.67 U1.4
  Bottom Layer w0.508: v1(23.65,11.05) 22.89,11.81 16.21,11.81 14.43,13.59 14.43,15.57 14.4,15.6 v1(14.4,15.67)
VOUT: length 19.3
  Top Layer w0.381: D2.1 32.28,14.02 R5.2 32.3,10.85 LED5.2 32.3,5.74 31.59,5.03 24.94,5.03 24.41,4.5 21.89,4.5 R9.1
$1N828: length 11.8
  Top Layer w0.381: U3.3 24.57,13.3 v1(23.5,13.3) R6.2 ; v1(30.78,12.67) 30.78,10.89 R5.1
  Bottom Layer w0.381: v1(30.78,12.67) 30.16,13.3 v1(23.5,13.3)
$1N1510: length 14.3
  Top Layer w0.762: DC1.1 14.43,28.4 15.77,29.74 19.79,29.74 20.78,28.75 SW1.2
$1N2340: length 4.5
  Top Layer w0.381: LED4.2 5.5,4.93 9.97,4.93
$1N2345: length 4.2
  Top Layer w0.381: 8.1,6.52 8.1,7.21 8.71,7.82 11.38,7.82
$1N2357: length 8.1
  Top Layer w0.381: 11.38,9.09 6.12,9.09 5.49,8.46 5.49,6.52 LED4.1
$1N2904: length 2.6
  Top Layer w0.381: U4.2 19.37,7.82 R8.2
$1N3168: length 3.2
  Top Layer w0.381: R10.2 30.67,6.25 LED5.1
$1N3244: length 2.4
  Top Layer w0.762: 28.43,24.92 28.41,24.94 LED6.1

## Copper pours and planes (outline as drawn; the poured copper is in the pictures)
GND on Top Layer: -2.64,35.58 36,35.58 36,-0.23 -2.64,-0.23
GND on Bottom Layer: -2.67,35.51 35.97,35.51 35.97,-0.31 -2.67,-0.31
VBAT on Top Layer: 2.21,15.47 12.5,15.47 12.5,9.8 2.21,9.8
VBAT on Top Layer: 18.77,20.42 26.19,20.42 26.19,7.47 18.77,7.47
$1N741 on Top Layer: 26.12,20.42 33.96,20.42 33.96,11.94 26.12,11.94

Small or netless copper shapes (teardrops, artwork), in the pictures only: 68 on Top Layer, 4 on Bottom Layer

## Text on the board
Top Silkscreen Layer: B5 | GND | 升压 | + | -

# Board PCB3
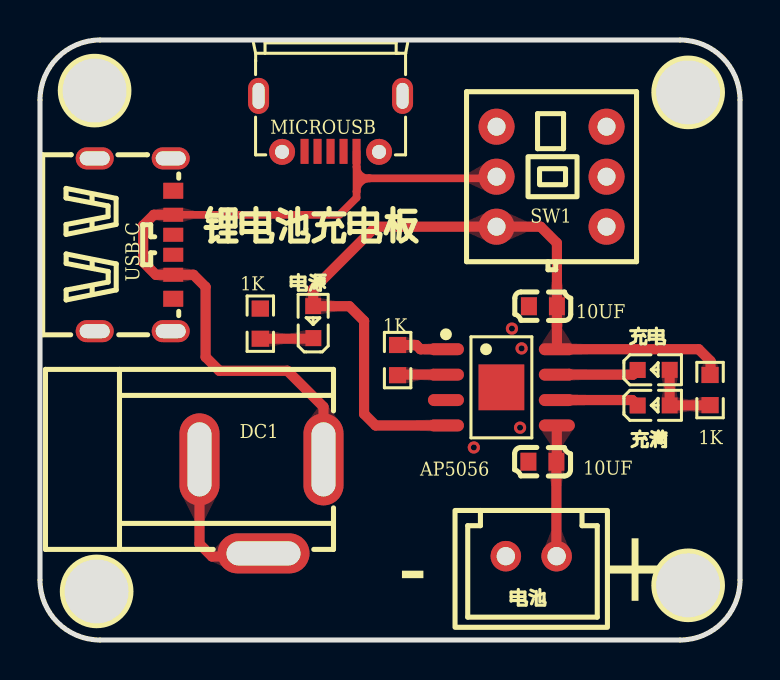
[diagram p5: board, top side]
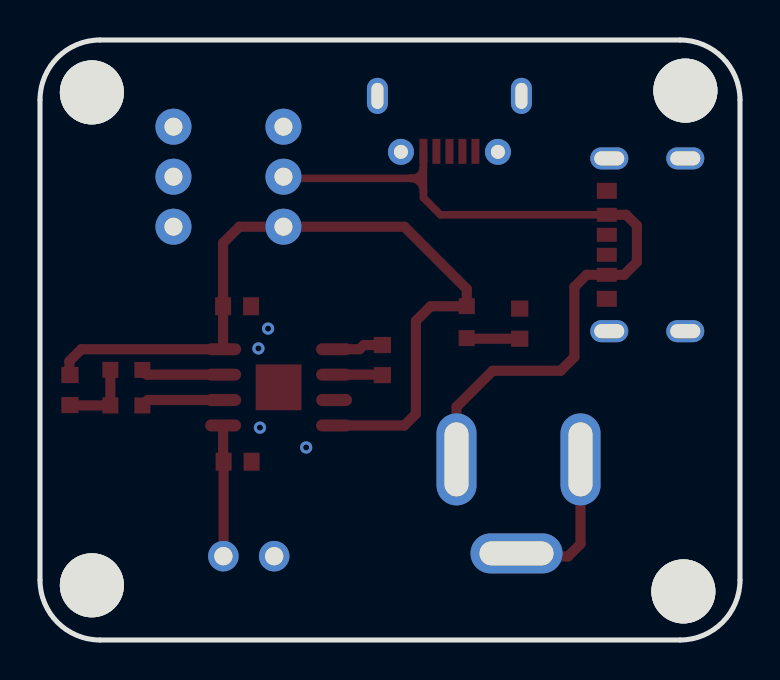
[diagram p6: board, bottom side, seen from below]

Outline 35 x 30 mm; copper layers: Top Layer, Bottom Layer. Coordinates in mm from the lower left corner of the outline.
Outline path: 0,27 0,3 arc(0.88,0.88) 3,0 32,0 arc(34.12,0.88) 35,3 35,27 arc(34.12,29.12) 32,30 3,30 arc(0.88,29.12) 0,27
Stack: Top Layer 0.035mm / Dielectric1 1.51mm FR4 er 4.5 / Bottom Layer 0.035mm

## Design rules (mm)
template: JLCPCB Capability(Two Layers Board)
spacing copperThickness1oz (default): track to track 0.102, other pairs 0.152 to 0.3
spacing copperThickness2oz: track to track 0.203, other pairs 0.152 to 0.3
track width copperThickness1oz (default): min 0.127, default 0.254, max 2.54
track width copperThickness2oz: min 0.203, default 0.254, max 2.54
differential pair differentialPair (default): width min 0.127, default 0.254, max 2.54; gap min 0.152, default 0.152
via viaSize (default): diameter min 0.5, default 0.61, max 10; hole min 0.3, default 0.305, max 6.3

## Placement (name value [footprint] x y rotation side)
1K  -  [R0603]  33.5 12.5 90 top
1K#2  -  [R0603]  17.88 14 270 top
1K#3  -  [R0603]  11.02 15.82 270 top
10UF  -  [C0603]  25.12 8.92 180 top
10UF#2  -  [C0603]  25.15 16.69 0 top
AP5056  -  [SOP-8_L4.9-W3.9-P1.27-LS6.0-BL-EP]  23.07 12.63 270 top
DC1  DC005  [DC-IN-TH_DC005]  11.07 6.68 0 top
MICROUSB  -  [MICRO-USB-SMD_U-F-M5DD-Y-C]  14.53 25.81 180 top
SW1  SP-2214  [SW-TH_6P-L8.5-W8.5-P2.54-LS5.5]  25.58 23.17 270 top
TP1  -  [M3螺丝]  2.9 2.37 0 top
TP2  -  [M3螺丝]  2.79 27.41 0 top
TP3  -  [M3螺丝]  32.47 27.32 0 top
TP4  -  [M3螺丝]  32.47 2.67 0 top
USB-C
  -  [TYPE-C-SMD_TYPE-C-6P]  4.7 19.76 270 top
充满  -  [LED_0603]  30.73 11.73 0 top
充电  -  [LED_0603]  30.73 13.51 0 top
电池  -  [CONN-TH_2P-P2.54_HDR2]  24.56 4.19 180 top
电源  -  [LED_0603]  13.66 15.94 90 top

## Footprints (pads in the part's own frame, mm; a bottom-side part is the same pattern mirrored in y, then rotated)
C0603
  rect 0.8x0.9 smd: 1(-0.7,0) 2(0.7,0)
CONN-TH_2P-P2.54_HDR2
  round 1.524 hole 0.914: 1(-1.27,0) 2(1.27,0)
DC-IN-TH_DC005
  oval 2x4.6 hole 1.2x3.7: 1(3.1,2.35) 2(-3.1,2.35)
  oval 4.6x2 hole 3.7x1.2: 3(0.1,-2.35)
LED_0603
  rect 0.8x0.8 smd: 1(-0.851,-0.01) 2(0.75,-0.005)
M3螺丝
  round 3.2 hole 3.2: 1(-0.064,0.064)
MICRO-USB-SMD_U-F-M5DD-Y-C
  rect 0.4x1.25 smd: 1(-1.3,1.375) 2(-0.65,1.375) 3(0,1.375) 4(0.65,1.375) 5(1.3,1.375)
  round 1.3 hole 0.7: 6(-2.425,1.4) 7(2.425,1.4)
  oval 1.05x1.8 hole 0.6x1.3: 8(-3.6,-1.4) 9(3.6,-1.4)
R0603
  rect 0.806x0.864 smd: 1(-0.753,0) 2(0.753,0)
SOP-8_L4.9-W3.9-P1.27-LS6.0-BL-EP
  oval 0.6x1.8 smd: 1(-1.905,-2.772) 2(-0.635,-2.772) 3(0.635,-2.772) 4(1.905,-2.772) 5(1.905,2.772) 6(0.635,2.772) 7(-0.635,2.772) 8(-1.905,2.772)
  rect 2.29x2.29 smd: 9(0,0)
SW-TH_6P-L8.5-W8.5-P2.54-LS5.5
  round 1.8 hole 0.9: 1(-2.5,-2.75) 2(0,-2.75) 3(2.5,-2.75) 4(-2.5,2.75) 5(0,2.75) 6(2.5,2.75)
TYPE-C-SMD_TYPE-C-6P
  oval 1.1x1.9 hole 0.7x1.5: 7(-4.32,1.837) 7(-4.32,-1.962) 7(4.32,1.837) 7(4.32,-1.962)
  rect 0.7x1 smd: A5(-0.5,1.962) A9(1.5,1.962) B5(0.5,1.962) B9(-1.5,1.962)
  rect 0.8x1 smd: A12(2.7,1.962) B12(-2.7,1.962)

## Nets
+5V: 1K.2 10UF#2.2 AP5056.4 AP5056.8 SW1.3 电源.2
GND: 1K#2.1 1K#3.1 10UF.2 10UF#2.1 AP5056.1 AP5056.3 AP5056.9 DC1.2 DC1.3 MICROUSB.5 USB-C
.A12 USB-C
.B12 电池.2
VBAT: 10UF.1 AP5056.5 电池.1
VCC: DC1.1 MICROUSB.1 SW1.2 USB-C
.A9 USB-C
.B9
$1N946: 1K.1 充满.2 充电.2
$1N947: AP5056.7 充电.1
$1N948: AP5056.6 充满.1
$1N950: 1K#2.2 AP5056.2
$1N960: 1K#3.2 电源.1

Pads without a net: MICROUSB 2 3 4 6 7 8 9; SW1 1 4 5 6; TP1 1; TP2 1; TP3 1; TP4 1; USB-C
 7 A5 B5

## Via types
v1: diameter 0.61, hole 0.305, Top Layer to Bottom Layer, 4 vias

## Routing (per net, layer and track width the routed paths; a pad name or vN(x,y) marks a point on that pad's centre or on a via; arc(x,y) is an arc through that point)
+5V: length 40.4
  Top Layer w0.508: AP5056.4 16.78,10.73 16.21,11.3 16.21,15.95 15.47,16.69 13.67,16.69 电源.2 13.66,17.55 16.78,20.67 SW1.3 25.03,20.67 25.85,19.85 10UF#2.2 25.85,14.54 AP5056.8 32.93,14.54 33.53,13.94 33.53,13.28 1K.2
GND: length 10
  Top Layer w0.508: AP5056.1 19.02,14.54 18.81,14.75 17.88,14.75 ; 11.17,4.18 8.6,4.18 7.98,4.8 7.98,8.88
  vias: v1(21.69,9.63) v1(23.6,15.57) v1(24,10.62) v1(24.08,14.58)
VBAT: length 6.4
  Top Layer w0.508: 10UF.1 25.82,4.2 电池.1 ; AP5056.5 25.84,9.1
VCC: length 40.6
  Top Layer w0.381: MICROUSB.1 15.83,23.66 ; 15.83,23.66 15.83,22.43 ; 15.83,23.66 arc(16,23.25) 16.4,23.08 16.49,23.08 ; USB-C
.B9 14.98,21.26 15.83,22.11 15.83,22.43 ; 15.83,22.43 arc(16.02,22.89) 16.49,23.08 ; 16.49,23.08 22.75,23.08 SW1.2
  Top Layer w0.508: USB-C
.B9 5.69,21.26 5.16,20.73 5.16,18.9 5.79,18.26 USB-C
.A9 7.67,18.26 8.28,17.65 8.28,14.15 8.97,13.46 12.37,13.46 14.17,11.66 14.17,8.88
$1N946: length 3.8
  Top Layer w0.508: 1K.1 33.49,11.73 充满.2 充电.2
$1N947: length 4.1
  Top Layer w0.508: AP5056.7 29.65,13.27 29.88,13.5
$1N948: length 4.2
  Top Layer w0.508: AP5056.6 29.61,12 充满.1
$1N950: length 2.4
  Top Layer w0.508: AP5056.2 17.91,13.27 1K#2.2
$1N960: length 2.7
  Top Layer w0.508: 13.67,15.09 13.64,15.06 1K#3.2

## Copper pours and planes (outline as drawn; the poured copper is in the pictures)
GND on Top Layer: -0.38,31.7 35.97,31.7 35.97,-1.02 -0.38,-1.02
GND on Top Layer: -0.38,31.7 35.97,31.7 35.97,-1.02 -0.38,-1.02

Small or netless copper shapes (teardrops, artwork), in the pictures only: 35 on Top Layer

## Text on the board
Top Silkscreen Layer: 锂电池充电板 | - | +

# Board PCB1
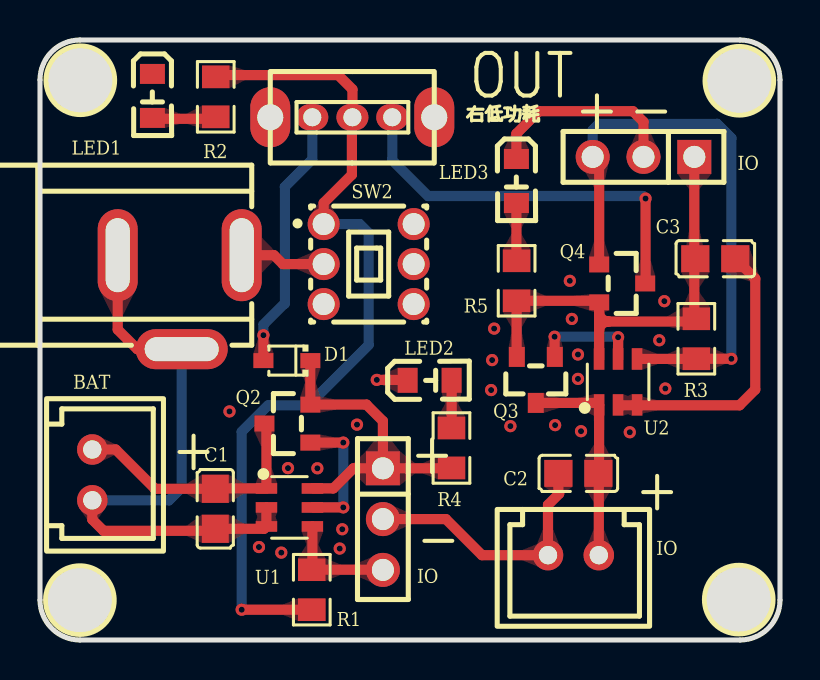
[diagram p7: board, top side]
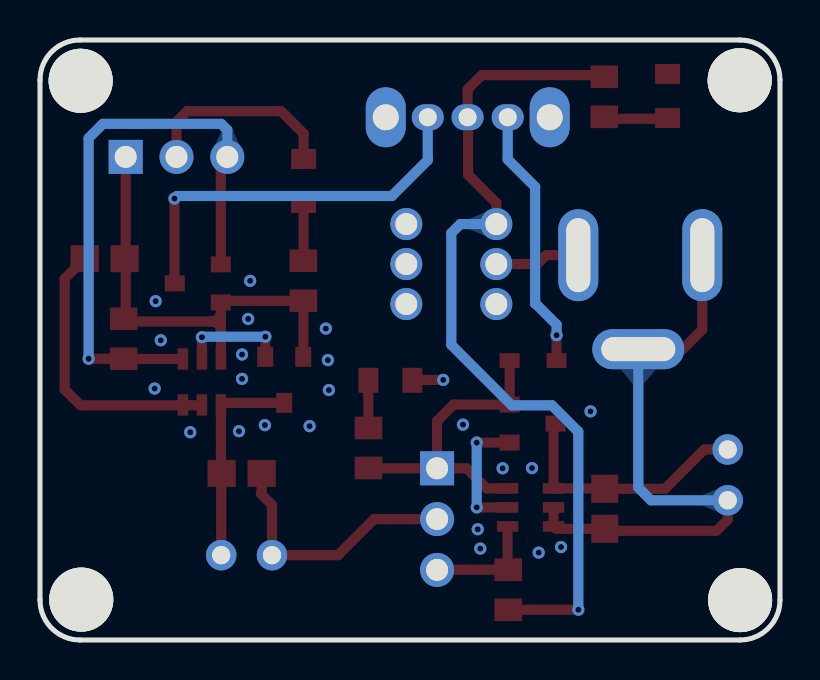
[diagram p8: board, bottom side, seen from below]

Outline 37 x 30 mm; copper layers: Top Layer, Bottom Layer. Coordinates in mm from the lower left corner of the outline.
Outline path: 0,28 0,2 arc(0.59,0.59) 2,0 35,0 arc(36.41,0.59) 37,2 37,28 arc(36.41,29.41) 35,30 2,30 arc(0.59,29.41) 0,28
Stack: Top Layer 0.035mm / Dielectric1 1.51mm FR4 er 4.5 / Bottom Layer 0.035mm

## Design rules (mm)
template: JLCPCB Capability(Two Layers Board)
spacing copperThickness1oz (default): track to track 0.102, other pairs 0.152 to 0.3
spacing copperThickness2oz: track to track 0.203, other pairs 0.152 to 0.3
track width copperThickness1oz (default): min 0.127, default 0.254, max 2.54
track width copperThickness2oz: min 0.203, default 0.254, max 2.54
differential pair differentialPair (default): width min 0.127, default 0.254, max 2.54; gap min 0.152, default 0.152
via viaSize (default): diameter min 0.5, default 0.61, max 10; hole min 0.3, default 0.305, max 6.3

## Placement (name value [footprint] x y rotation side)
BAT  -  [CONN-TH_2P-P2.54_HDR2]  2.62 8.25 270 top
C1  1uF  [C0805]  8.76 6.56 90 top
C2  0.1uF-10uF  [C0805]  26.92 8.33 0 top
C3  1uF-47uF  [C0805]  33.77 19.06 180 top
D1  1N5819WS  [SOD-323_L1.8-W1.3-LS2.5-RD]  12.34 13.97 180 top
DC1  DC005  [DC-IN-TH_DC005]  6.98 16.89 0 top
IO  -  [HDR-TH_3P-P2.54-V-M]  30.17 24.16 180 top
IO#2  -  [HDR-TH_3P-P2.54-V-M]  17.14 6.05 270 top
IO#3  -  [CONN-TH_2P-P2.54_HDR2]  26.67 4.24 180 top
LED1  -  [LED_0805]  5.62 27.15 270 top
LED2  -  [LED_0805]  19.53 12.98 0 top
LED3  -  [LED_0805]  23.82 22.9 270 top
Q2  -  [AO3401A_SOT-23-3]  12.37 10.82 0 top
Q3  -  [AO3401A_SOT-23-3]  24.79 13 90 top
Q4  -  [AO3401A_SOT-23-3]  29.11 17.83 180 top
R1  470K  [R0805]  13.59 2.51 90 top
R2  5.1K  [R0805]  8.79 27.16 270 top
R3  470K  [R0805]  32.82 15.06 90 top
R4  1K  [R0805]  20.57 9.6 90 top
R5  1K  [R0805]  23.83 17.96 90 top
SW2  自锁开关 5.8Z白灰白260G  [SW-TH_6P-L5.8-W5.8-P2.00-LS4.5-TR]  16.43 18.8 90 top
TP1  -  [M3螺丝]  2.06 1.93 0 top
TP2  -  [M3螺丝]  2.08 27.92 0 top
TP3  -  [M3螺丝]  35.03 27.9 0 top
TP4  -  [m3螺丝]  35 1.96 0 top
U1  LTC4412MPS6#TRPBF  [SOT-23-6_L2.9-W1.6-P0.95-LS2.8-BL]  12.47 6.63 270 top
U2  LTC4412MPS6#TRPBF  [SOT-23-6_L2.9-W1.6-P0.95-LS2.8-BL]  28.91 12.9 0 top
右低功耗  -  [拨动开关]  15.75 26.14 180 top

## Footprints (pads in the part's own frame, mm; a bottom-side part is the same pattern mirrored in y, then rotated)
AO3401A_SOT-23-3
  rect 1x0.8 smd: 1(1.15,-0.95) 2(1.15,0.95) 3(-1.15,0)
C0805
  rect 1.41x1.35 smd: 1(-1,0) 2(1,0)
CONN-TH_2P-P2.54_HDR2
  round 1.524 hole 0.914: 1(-1.27,0) 2(1.27,0)
DC-IN-TH_DC005
  oval 2x4.6 hole 1.2x3.7: 1(3.1,2.35) 2(-3.1,2.35)
  oval 4.6x2 hole 3.7x1.2: 3(0.1,-2.35)
HDR-TH_3P-P2.54-V-M
  rect 1.7x1.7 hole 1.1: 1(-2.54,0)
  round 1.7 hole 1.1: 2(0,0) 3(2.54,0)
LED_0805
  rect 1x1.25 smd: 1(-1.15,0.005) 2(1.05,0.005)
m3螺丝
  round 3.2 hole 3.2: 1(-0.064,0.064)
M3螺丝
  round 3.2 hole 3.2: 1(-0.064,0.064)
R0805
  rect 1.133x1.377 smd: 1(-1,0) 2(1,0)
SOD-323_L1.8-W1.3-LS2.5-RD
  rect 1x0.75 smd: 1(-1.173,0) 2(1.173,0)
SOT-23-6_L2.9-W1.6-P0.95-LS2.8-BL
  rect 0.532x1.072 smd: 1(-0.95,-1.149) 2(0,-1.149) 3(0.95,-1.149) 4(0.95,1.149) 5(0,1.149) 6(-0.95,1.149)
SW-TH_6P-L5.8-W5.8-P2.00-LS4.5-TR
  round 1.6 hole 1.1: 1(2,2.25) 2(0,2.25) 3(-2,2.25) 4(-2,-2.25) 5(0,-2.25) 6(2,-2.25)
拨动开关
  oval 1.6x1.3 hole 0.899: 1(-1.865,0) 2(0.127,0) 3(2.134,0)
  oval 1.999x2.999 hole 1.3: 4(4.234,0) 5(-3.965,0)

## Nets
+5V: D1.2 右低功耗.3
+5V_2: Q4.3 右低功耗.1
GND: BAT.2 C1.1 C2.1 C3.1 DC1.2 DC1.3 IO.2 IO#2.2 IO#3.2 LED1.1 LED2.1 LED3.1 U1.2 U1.3 U2.2 U2.3
VCC: R1.1 R2.1 SW2.1 右低功耗.2
$1N424: Q2.1 U1.5
$1N428: BAT.1 C1.2 Q2.3 U1.1
$1N1051: LED1.2 R2.2
$1N1391: Q3.1 U2.5
$1N1394: C2.2 IO#3.1 Q3.3 U2.1
$1N1660: DC1.1 SW2.2
$1N1753: LED2.2 R4.2
$1N1817: LED3.2 R5.2
$1N1909: IO.3 Q4.1 R3.1 U2.4
$1N1921: C3.2 IO.1 Q3.2 Q4.2 R3.2 R5.1 U2.6
$1N2014: IO#2.3 R1.2 U1.4
$1N2028: D1.1 IO#2.1 Q2.2 R4.1 U1.6

Pads without a net: SW2 3 4 5 6; TP1 1; TP2 1; TP3 1; TP4 1; 右低功耗 4 5

## Via types
v1: diameter 0.61, hole 0.305, Top Layer to Bottom Layer, 31 vias

## Routing (per net, layer and track width the routed paths; a pad name or vN(x,y) marks a point on that pad's centre or on a via; arc(x,y) is an arc through that point)
+5V: length 13.2
  Top Layer w0.508: D1.2 v1(11.17,15.24)
  Bottom Layer w0.508: v1(11.17,15.24) 11.17,15.77 12.22,16.81 12.24,16.81 12.24,22.66 13.61,24.03 右低功耗.3
+5V_2: length 19.9
  Top Layer w0.508: Q4.3 30.28,17.85 v1(30.28,22.07)
  Bottom Layer w0.508: v1(30.28,22.07) 30.15,22.2 19.41,22.2 17.61,23.99 右低功耗.1
GND: length 69
  Top Layer w0.508: 3.89,19.24 3.89,15.52 4.86,14.54 DC1.3 ; U1.2 U1.3 11.2,5.56 C1.1 8.66,5.46 3.17,5.46 2.62,6.02 BAT.2 ; U2.2 28.92,11.73 34.98,11.73 35.76,12.52 35.76,18.07 C3.1 ; LED2.1 18.36,13 v1(16.84,13) ; C2.1 25.92,7.36 25.96,7.31 25.4,6.76 IO#3.2 22.1,4.24 20.29,6.05 IO#2.2 ; IO.2 30.17,25.91 29.64,26.44 24.94,26.44 23.82,25.32 LED3.1
  Bottom Layer w0.508: BAT.2 6.45,6.98 7.08,7.62 DC1.3
  vias: v1(9.47,11.43) v1(10.95,4.65) v1(12.06,4.37) v1(12.4,8.59) v1(13.87,8.58) v1(14.99,4.57) v1(15.11,5.54) v1(15.85,10.77) v1(22.61,14) v1(22.55,12.5) v1(22.71,15.57) v1(23.52,10.69) v1(25.76,10.74) v1(26.49,17.96) v1(26.59,16.05) v1(26.9,14.27) v1(26.9,13.06) v1(27.05,10.44) v1(29.49,10.39) v1(30.96,14.99) v1(31.22,16.94) v1(31.27,12.57)
VCC: length 43.1
  Top Layer w0.508: R1.1 v1(10.08,1.51) ; SW2.1 14.18,21.85 15.6,23.27 15.6,26.11 右低功耗.2 15.62,27.53 14.91,28.24 8.98,28.24 8.79,28.06
  Bottom Layer w0.508: v1(10.08,1.51) 10.08,10.41 11.4,11.73 13.41,11.73 16.43,14.76 16.43,20.35 15.98,20.8 SW2.1
$1N424: length 6.4
  Top Layer w0.508: U1.5 v1(15.16,6.63) ; Q2.1 v1(15.16,9.87)
  Bottom Layer w0.508: v1(15.16,9.87) v1(15.16,6.63)
$1N428: length 12.8
  Top Layer w0.508: Q2.3 11.32,10.72 U1.1 8.78,7.58 C1.2 5.75,7.56 3.78,9.52 BAT.1
$1N1051: length 3.2
  Top Layer w0.508: 8.72,26.06 5.54,26.06 arc(5.54,26.06) 5.54,26.05
$1N1391: length 5.3
  Top Layer w0.508: v1(25.73,15.16) 25.73,14.16 Q3.1 ; v1(28.91,15.14) U2.5
  Bottom Layer w0.508: v1(28.91,15.14) 28.88,15.16 v1(25.73,15.16)
$1N1394: length 10.8
  Top Layer w0.508: Q3.3 27.85,11.85 U2.1 27.95,8.32 27.94,8.31 ; 27.94,8.31 C2.2 ; 27.94,8.31 IO#3.1
$1N1660: length 4.3
  Top Layer w0.508: SW2.2 12.14,18.8 11.7,19.24 10.08,19.24
$1N1753: length 2.4
  Top Layer w0.508: LED2.2 20.58,10.61 R4.2
$1N1817: length 2.9
  Top Layer w0.508: R5.2 23.82,18.97 LED3.2
$1N1909: length 30
  Top Layer w0.508: IO.3 27.96,23.83 Q4.1 ; v1(34.57,14.06) R3.1 32.81,14.05 U2.4
  Bottom Layer w0.508: IO.3 27.63,25.5 27.94,25.81 33.86,25.81 34.57,25.09 v1(34.57,14.06)
$1N1921: length 24.3
  Top Layer w0.508: 28.43,15.92 32.68,15.92 R3.2 32.72,16.16 32.72,24.16 ; 28.43,15.92 27.95,15.92 ; 28.43,15.92 arc(28.09,16.06) 27.95,16.4 ; 28.43,15.92 arc(28.09,15.79) 27.95,15.45 ; 27.95,15.92 27.95,15.45 ; 27.95,15.92 27.95,16.4 ; 27.95,15.45 U2.6 ; Q3.2 23.83,14.16 R5.1 27.87,16.96 27.95,16.88 ; 27.95,16.4 27.95,16.88 ; 27.95,16.88 27.96,16.88
$1N2014: length 5.6
  Top Layer w0.508: 13.59,3.62 13.62,3.65 U1.4 ; IO#2.3 17.14,3.51 R1.2
$1N2028: length 15.9
  Top Layer w0.508: IO#2.1 15.67,8.58 14.67,7.58 U1.6 ; IO#2.1 17.14,10.95 16.32,11.77 Q2.2 13.52,11.77 D1.1 ; IO#2.1 20.48,8.58 20.57,8.68

## Copper pours and planes (outline as drawn; the poured copper is in the pictures)
GND on Top Layer: 0.18,30.58 38,30.58 38,-1.17 0.18,-1.17
GND on Bottom Layer: 0.18,30.58 38,30.58 38,-1.17 0.18,-1.17

Small or netless copper shapes (teardrops, artwork), in the pictures only: 76 on Top Layer, 6 on Bottom Layer

## Text on the board
Top Silkscreen Layer: + | - | OUT
